# EAGLE design Omega2-IO-Power-Full (EAGLE 7.7.0)
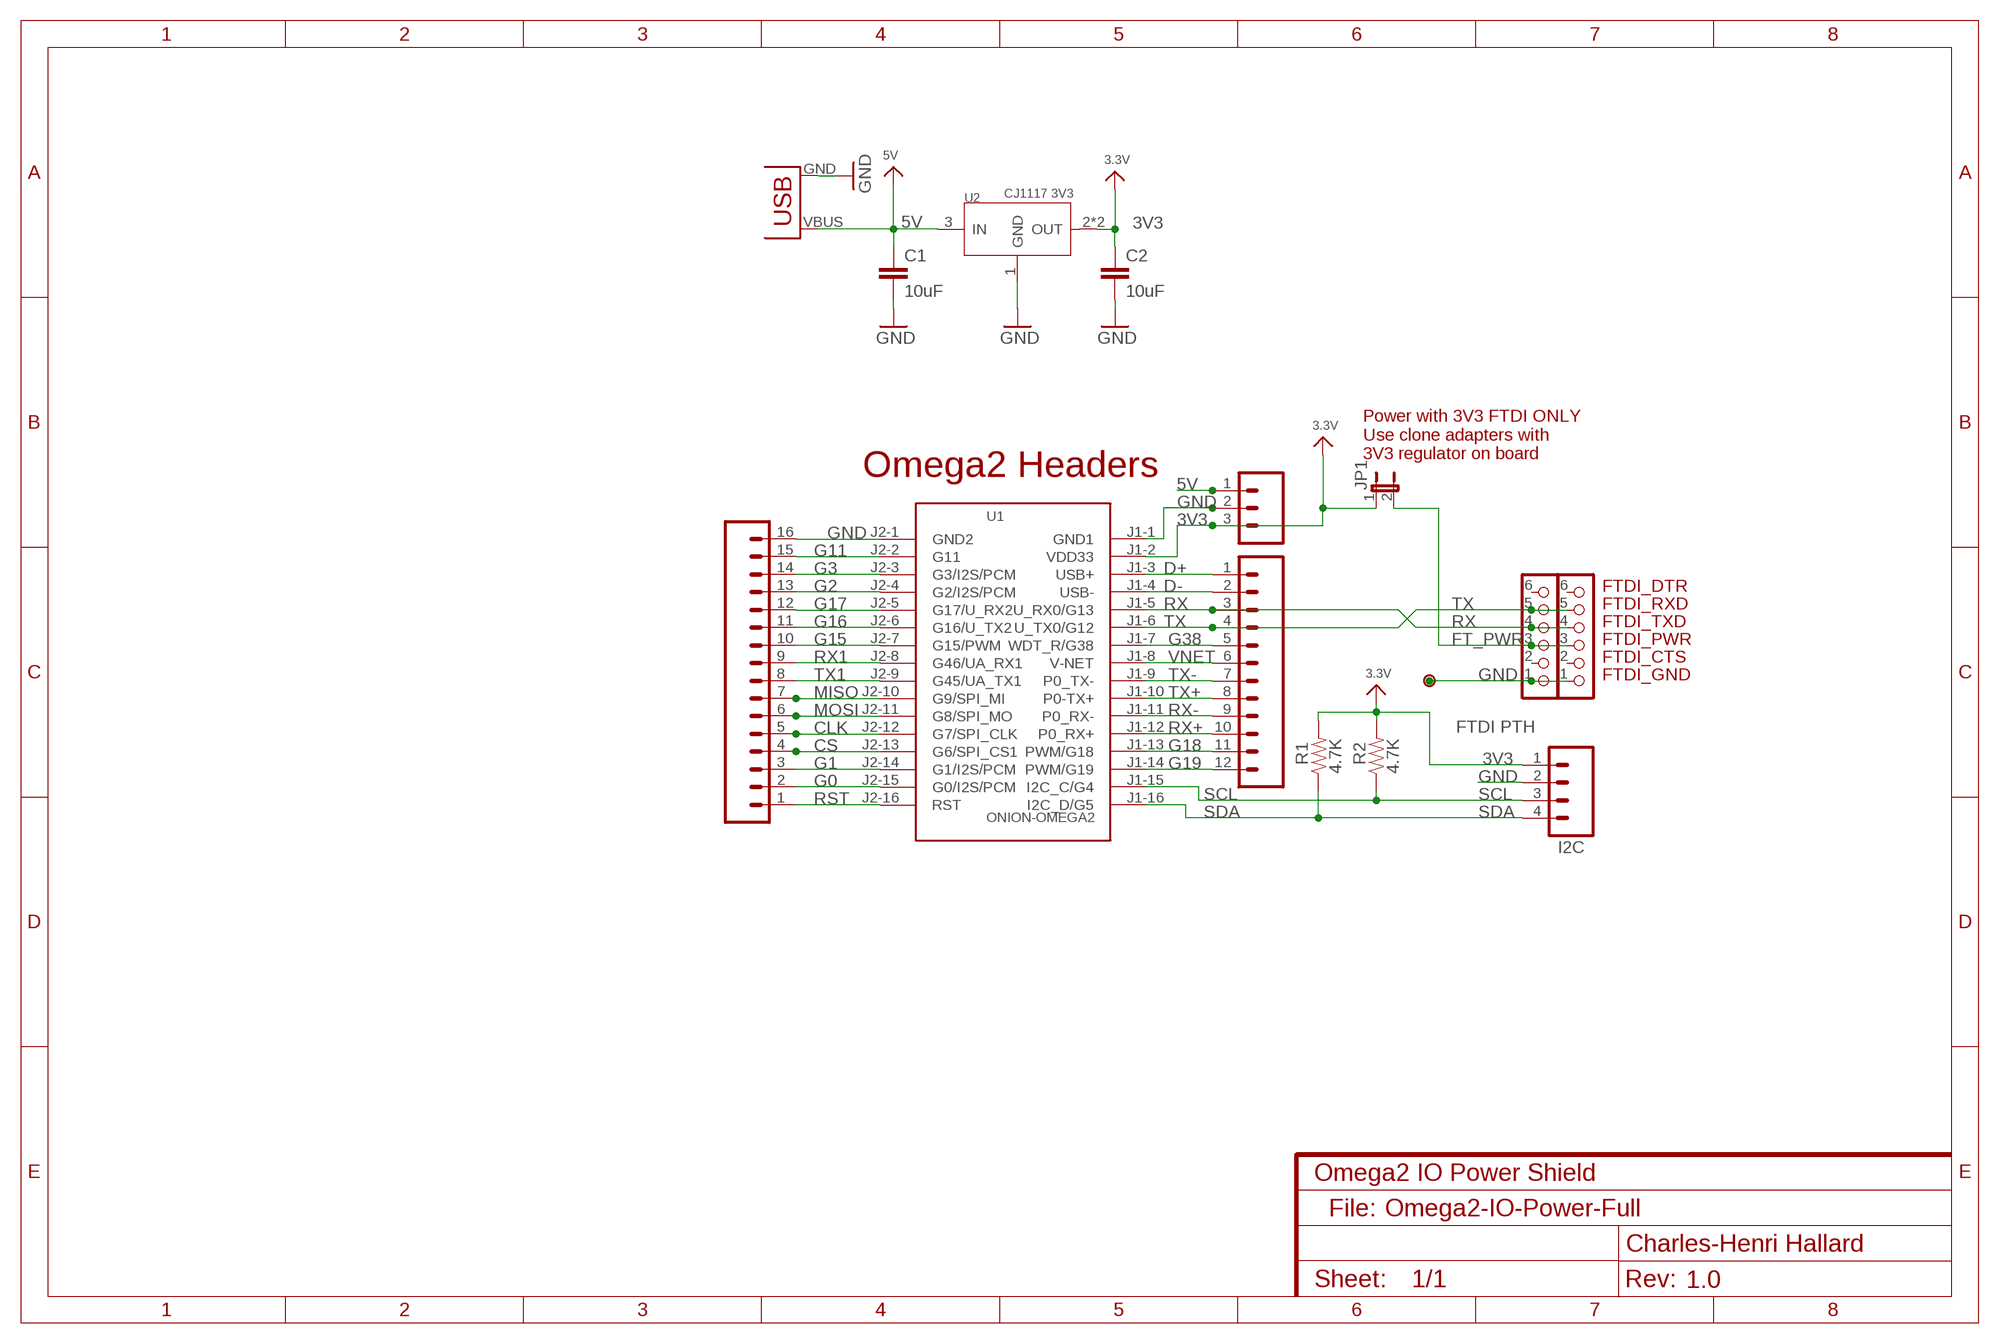
[diagram p0: schematic, sheet 1]
NAME (FRAME-A4L): CNAME: Omega2 IO Power Shield; CREVISION: 1.0; DESIGNER: Charles-Henri Hallard

## Parts
C1  10uF  CAP0805-CAP-LARGEPADS  [0805-CAP-LARGEPADS]
C2  10uF  CAP0805-CAP-LARGEPADS  [0805-CAP-LARGEPADS]
FTDI  CON_HEADER_1X06-PTH  [M1X6]
I2C  M04PTH  [1X04]
J1  M16PTH  [1X16]
J2  M12PTH  [1X12]
J7  M03PTH  [1X03]
JP1  JUMPER2  [JUMPER2]
P2  PADNORMAL  [PAD]
PTH  CON_HEADER_1X06  [M1X6_MALE_RIGHT_ANGLED_SMD_NO_HOLES]
R1  4.7K  RESISTOR0805-RES  [0805-RES]
R2  4.7K  RESISTOR0805-RES  [0805-RES]
U1  ONION-OMEGA2  [ONION-2MM-2X16]
U2  CJ1117 3V3  CJ1117-3.3-1310120P1  [SOT89]
USB  USB_POWER  [USB_MINIB_POWER]

## Nets
3V3: C2.1 I2C.1 J7.3 JP1.1 R1.2 R2.2 U1.J1-2(VDD33) U2.2(OUT) U2.4(OUT) ; supply symbol labelled 3.3V
5V: C1.1 J7.1 U2.3(IN) USB.VBUS(VCC)
CLK: J1.5 U1.J2-12(G7/SPI_CLK)
CS: J1.4 U1.J2-13(G6/SPI_CS1)
D+: J2.1 U1.J1-3(USB+)
D-: J2.2 U1.J1-4(USB-)
FT_PWR: FTDI.3 JP1.2 PTH.3
G0: J1.2 U1.J2-15(G0/I2S/PCM)
G1: J1.3 U1.J2-14(G1/I2S/PCM)
G2: J1.13 U1.J2-4(G2/I2S/PCM)
G3: J1.14 U1.J2-3(G3/I2S/PCM)
G11: J1.15 U1.J2-2(G11)
G15: J1.10 U1.J2-7(G15/PWM)
G16: J1.11 U1.J2-6(G16/U_TX2)
G17: J1.12 U1.J2-5(G17/U_RX2)
G18: J2.11 U1.J1-13(PWM/G18)
G19: J2.12 U1.J1-14(PWM/G19)
G38: J2.5 U1.J1-7(WDT_R/G38)
GND: C1.2 C2.2 FTDI.1 I2C.2 J1.16 J7.2 P2.1 PTH.1 U1.J1-1(GND1) U1.J2-1(GND2) U2.1(GND) USB.GND
MISO: J1.7 U1.J2-10(G9/SPI_MI)
MOSI: J1.6 U1.J2-11(G8/SPI_MO)
RST: J1.1 U1.J2-16(RST)
RX: FTDI.4 J2.3 PTH.4 U1.J1-5(U_RX0/G13)
RX1: J1.9 U1.J2-8(G46/UA_RX1)
RX+: J2.10 U1.J1-12(P0_RX+)
RX-: J2.9 U1.J1-11(P0_RX-)
SCL: I2C.3 R2.1 U1.J1-15(I2C_C/G4)
SDA: I2C.4 R1.1 U1.J1-16(I2C_D/G5)
TX: FTDI.5 J2.4 PTH.5 U1.J1-6(U_TX0/G12)
TX1: J1.8 U1.J2-9(G45/UA_TX1)
TX+: J2.8 U1.J1-10(P0-TX+)
TX-: J2.7 U1.J1-9(P0_TX-)
VNET: J2.6 U1.J1-8(V-NET)
Unconnected: FTDI.2 FTDI.6 PTH.2 PTH.6

## Notes on the sheet
- Power with 3V3 FTDI ONLY
  Use clone adapters with
  3V3 regulator on board
- Omega2 Headers
- FTDI_DTR
- FTDI_RXD
- FTDI_TXD
- FTDI_PWR
- FTDI_CTS
- FTDI_GND
- File:

## Library data of the parts
C1 C2 = _c2h:CAP: Capacitor Standard 0603 ceramic capacitor, and 0.1" leaded capacitor.
FTDI PTH = _c2h:CON_HEADER_1X06
I2C = SparkFun-Connectors:M04: Header 4 Standard 4-pin 0.1" header. Use with straight break away headers (SKU : PRT-00116), right angle break away headers (PRT-00553), swiss pins (PRT-00743), machine pins (PRT-00117), and female headers (PRT-00115). Molex polarized connector foot print use with SKU : PRT-08231 with associated crimp pins and housings. 1MM SMD Version SKU: PRT-10208; PROD_ID: CONN-09696
J1 = SparkFun-Connectors:M16: 1x16 .1" header
J2 = SparkFun-Connectors:M12: Header 12 Standard 12-pin 0.1" header. Use with straight break away headers (SKU : PRT-00116), right angle break away headers (PRT-00553), swiss pins (PRT-00743), machine pins (PRT-00117), and female headers (PRT-00115).
J7 = SparkFun-Connectors:M03: Header 3 Standard 3-pin 0.1" header. Use with straight break away headers (SKU : PRT-00116), right angle break away headers (PRT-00553), swiss pins (PRT-00743), machine pins (PRT-00117), and female headers (PRT-00115). Molex polarized connector foot print use with SKU : PRT-08232 with associated crimp pins and housings.
JP1 = microbuilder:JUMPER2: JUMPER - 2 Pins
P2 = _c2h:PAD
R1 R2 = _c2h:RESISTOR: Resistor Basic schematic elements and footprints for 0603, 1206, and PTH resistors.
U1 = Onion2:ONION-OMEGA2: Onion Omega
U2 = Seeed-IC:CJ1117-3.3: 1A Low Dropout Linear Regulator
USB = _c2h:USB_POWER

## Net classes
0 default: width 0.203 mm, drill 0.356 mm, clearance 0.152 mm
1 power: width 0.203 mm, clearance 0.152 mm

## Board
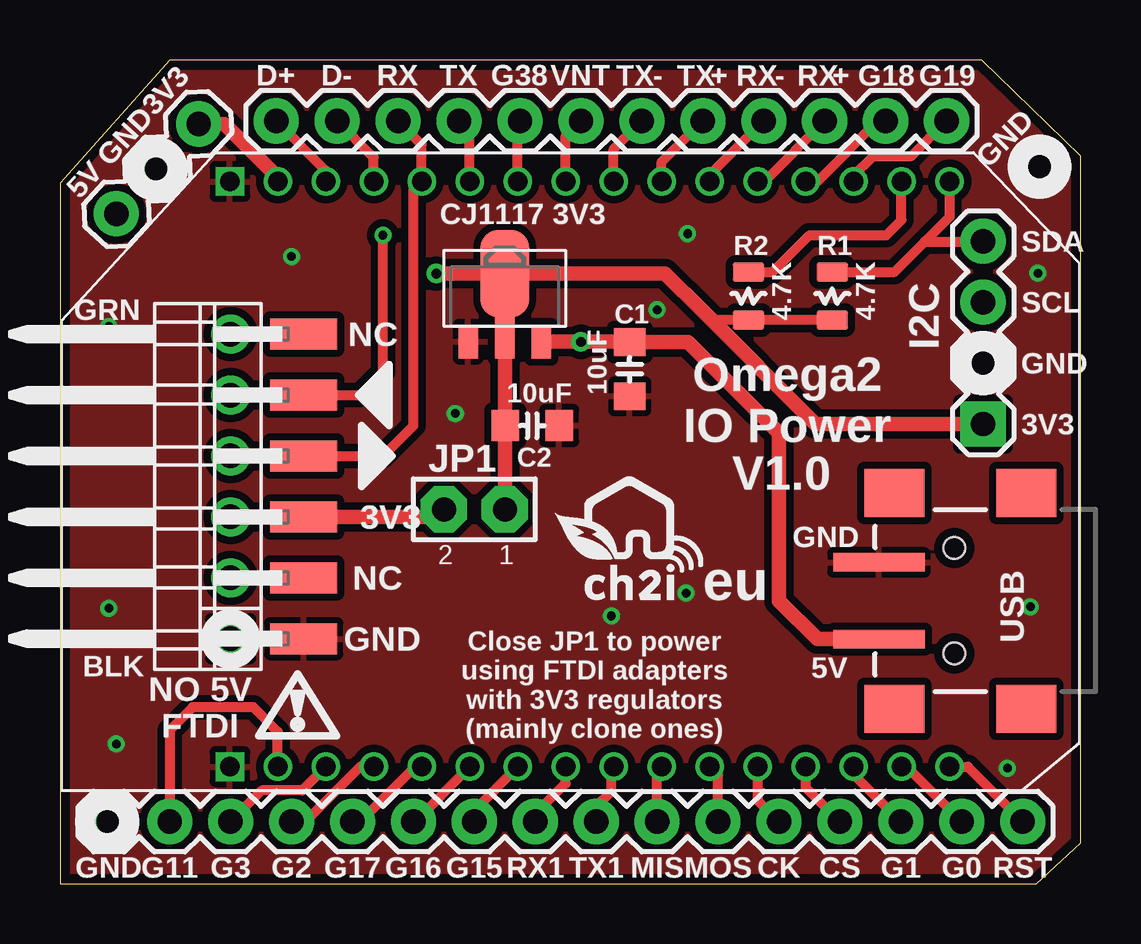
[diagram p1: board, top side]
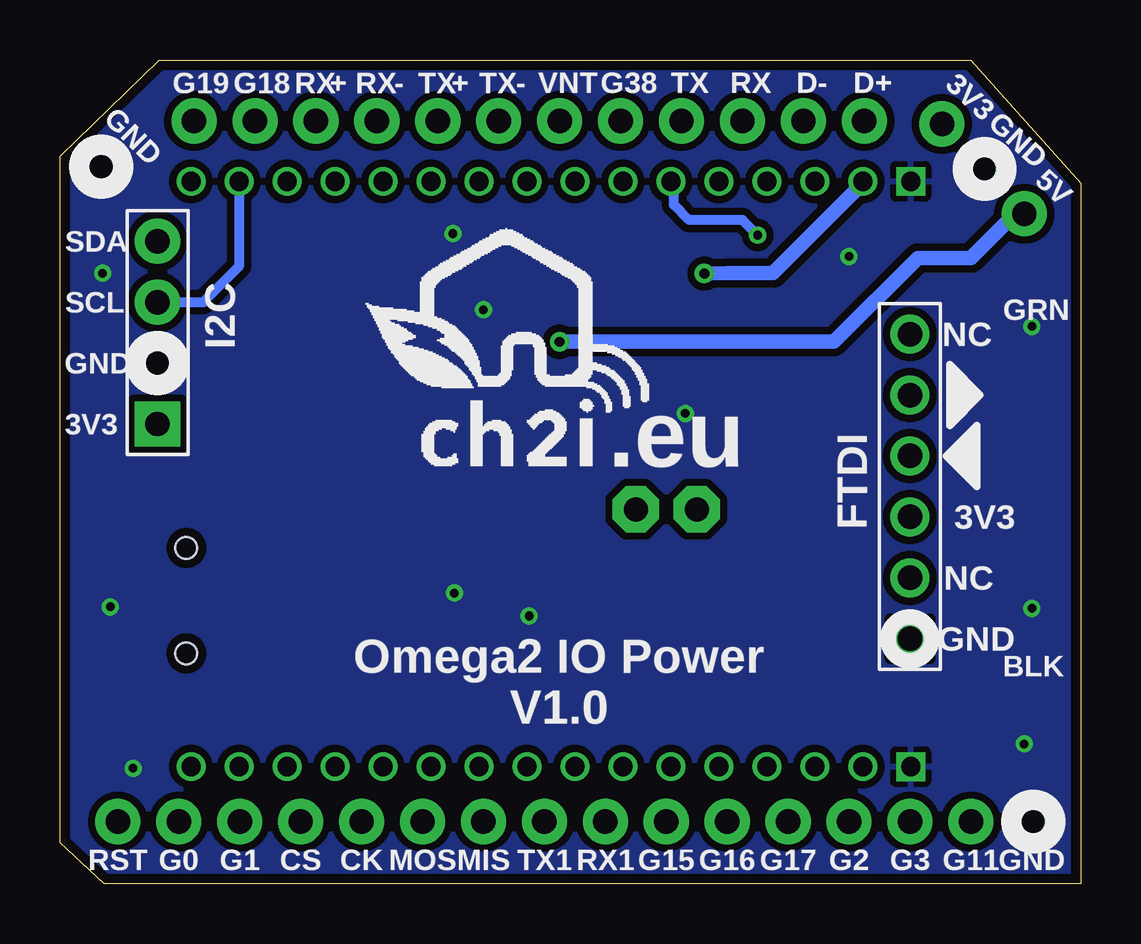
[diagram p2: board, bottom side, seen from below]

Size 42.55 x 34.35 mm. Coordinates in mm from the lower left corner, seen from the top.
Outline: 0,29.21 0,0 40.7,0 42.55,1.71 42.55,30.35 38.42,34.35 4.57,34.35 0,29.21
Copper layers (1*16): Top 0.0356mm / dielectric 1.5011mm / Bottom 0.0356mm
Design rules "PCBs_io": minimum track width 6mil, minimum drill 13mil, track to track 6mil, track to pad 6mil, pad to pad 6mil, via to via 6mil, smd to smd 6mil, copper to edge 15mil, drill to drill 6mil, minimum pad ring 7mil, minimum via ring 7mil, stop-mask expansion 3mil, vias tented up to drill 40mil, thermal gap 10mil

### Footprints (pad centres in the part's own frame; a part is rotated, then mirrored left to right if it is on the bottom)
0805-CAP-LARGEPADS = smd 1.156 x 1.3: 1 -1.127,0; 2 1.127,0
M1X6 = drill 1.02 pad 1.632 square: 1 0,0 | drill 1.02 pad 1.632: 2 2.54,0; 3 5.08,0; 4 7.62,0; 5 10.16,0; 6 12.7,0
1X04 = drill 1.016 pad 1.88 square: 1 0,0 | drill 1.016 pad 1.88: 2 2.54,0; 3 5.08,0; 4 7.62,0
1X16 = drill 1.016 pad 1.88: 1 0,0; 2 2.54,0; 3 5.08,0; 4 7.62,0; 5 10.16,0; 6 12.7,0; 7 15.24,0; 8 17.78,0; 9 20.32,0; 10 22.86,0; 11 25.4,0; 12 27.94,0; 13 30.48,0; 14 33.02,0; 15 35.56,0; 16 38.1,0
1X12 = drill 1.016 pad 1.88: 1 0,0; 2 2.54,0; 3 5.08,0; 4 7.62,0; 5 10.16,0; 6 12.7,0; 7 15.24,0; 8 17.78,0; 9 20.32,0; 10 22.86,0; 11 25.4,0; 12 27.94,0
1X03 = drill 1.016 pad 1.88: 1 0,0; 2 2.54,0; 3 5.08,0
JUMPER2 = drill 1 pad 1.93 octagon: 1 2.54,0; 2 0,0
PAD = drill 1.016 pad 1.88: 1 0,0
M1X6_MALE_RIGHT_ANGLED_SMD_NO_HOLES = smd 1.3 x 2.8: 1 -6.35,-4.951; 2 -3.81,-4.951; 3 -1.27,-4.951; 4 1.27,-4.951; 5 3.81,-4.951; 6 6.35,-4.951
0805-RES = smd 0.8 x 1.3: 1 -1,0; 2 1,0
ONION-2MM-2X16 = drill 0.8 square: J1-1 12.4,14; J2-1 -12,14 | drill 0.8: J1-2 12.4,12; J1-3 12.4,10; J1-4 12.4,8; J1-5 12.4,6; J1-6 12.4,4; J1-7 12.4,2; J1-8 12.4,0; J1-9 12.4,-2; J1-10 12.4,-4; J1-11 12.4,-6; J1-12 12.4,-8; J1-13 12.4,-10; J1-14 12.4,-12; J1-15 12.4,-14; J1-16 12.4,-16; J2-2 -12,12; J2-3 -12,10; J2-4 -12,8; J2-5 -12,6; J2-6 -12,4; J2-7 -12,2; J2-8 -12,0; J2-9 -12,-2; J2-10 -12,-4; J2-11 -12,-6; J2-12 -12,-8; J2-13 -12,-10; J2-14 -12,-12; J2-15 -12,-14; J2-16 -12,-16
SOT89 = smd 0.8 x 1.4: 1 -1.524,-1.905; 3 1.524,-1.905 | smd 0.8 x 1.9: 2 0,-1.651 | smd 2.032 x 3.65: 4 0,0.94
USB_MINIB_POWER = smd 3.81 x 0.762: GND 4.405,-1.6; VBUS 4.405,1.6 | smd 2.5 x 2: GND@1 -1.73,-4.5; GND@2 -1.73,4.5; GND@3 3.77,4.5; GND@4 3.77,-4.5 | hole 0.9: 1.27,2.2; 1.27,-2.2

### Placement (x,y rotation side)
C1  23.75,21.46 270 top
C2  19.69,19.11 0 top
FTDI  7.11,10.22 90 top
I2C  38.48,19.18 90 top
J1  40.13,2.6 180 top
J2  9.02,31.81 0 top
J7  2.35,27.94 47.5 top
JP1  16,15.62 0 top
P2  40.83,29.91 0 top
PTH  5.21,16.57 90 top
R1  32.19,24.51 270 top
R2  28.7,24.51 270 top
U1  21.08,16.89 90 top
U2  18.54,24.51 0 top
U$2  [LOGO_C2I_015]  20.64,11.81 0 top
U$3  [LOGO_CH2I_110MM]  23.3,20.38 0 bottom
USB  38.54,11.81 180 top

### Tracks (layer width: path | path; a pad name or v marks a point on that pad's centre or on a via)
3V3  (via drill 0.41 pad 0.81)
  Top 0.406: R1.2 R2.2 27.16,23.51 26.8,23.88
  Top 0.61: 19.16,25.44 U2.4 | U2.4 U2.2 18.54,19.13 C2.1 18.54,19.1 JP1.1 | I2C.1 31.5,19.18 26.8,23.88 25.22,25.45 v15.69,25.45 U2.4 | J7.3 6.86,31.69 9.08,29.46 U1.J1-2
  Bottom 0.61: U1.J1-2 9.08,29.21 12.83,25.46 14.72,25.46 v15.69,25.45
5V  (via drill 0.41 pad 0.81)
  Top 0.61: USB.VBUS 31.57,10.21 29.97,11.81 29.97,18.8 26.18,22.59 C1.1 24.37,22.61 v21.72,22.61 U2.3
  Bottom 0.61: v21.72,22.61 10.29,22.61 6.79,26.1 4.57,26.1 2.73,27.94 J7.1
CLK
  Top 0.406: U1.J2-12 29.08,3.49 J1.5
CS
  Top 0.406: U1.J2-13 31.08,4.03 J1.4
D+
  Top 0.406: U1.J1-3 11.08,29.75 J2.1
D-
  Top 0.406: U1.J1-4 13.08,30.29 J2.2
FT_PWR
  Top 0.61: FTDI.3 PTH.3 15.69,15.3 JP1.2
G0
  Top 0.406: U1.J2-15 35.3,4.89 J1.2
G1
  Top 0.406: U1.J2-14 33.08,4.57 J1.3
G2
  Top 0.406: U1.J2-4 12.51,4.89 10.22,2.6 J1.13
G3
  Top 0.406: J1.14 8.41,3.9 10.1,3.9 U1.J2-3
G11
  Top 0.406: U1.J2-2 9.08,6.35 8.06,7.37 5.52,7.37 4.57,6.41 J1.15
G15
  Top 0.406: J1.10 17.27,3.08 U1.J2-7
G16
  Top 0.406: J1.11 14.79,2.6 U1.J2-6
G17
  Top 0.406: J1.12 12.51,2.6 14.8,4.89 U1.J2-5
G18
  Top 0.406: U1.J1-13 31.58,29.29 34.1,31.81 J2.11
G19
  Top 0.406: U1.J1-14 33.08,29.53 33.91,30.35 35.5,30.35 J2.12
G38
  Top 0.406: U1.J1-7 19.08,31.72 J2.5
GND  (via drill 0.36 pad 0.71)
  other vias: 2.03,23.24 2.03,11.49 39.5,4.83 40.77,25.46 22.99,11.18 26.1,12.13 24.89,23.94 9.65,26.16 16.48,19.62 26.16,27.11 40.45,11.56 2.35,5.84
  pour Bottom (isolate 0.305): 43.62,35.31 43.62,-0.89 -1.14,-0.89 -1.14,35.31
  pour Top (isolate 0.305): -0.51,34.67 42.99,34.67 42.99,-0.25 -0.51,-0.25
MISO
  Top 0.406: J1.7 24.89,4.7 U1.J2-10
MOSI
  Top 0.406: J1.6 27.43,4.54 U1.J2-11
RST
  Top 0.406: U1.J2-16 37.84,4.89 J1.1
RX
  Top 0.406: J2.3 15.08,30.83 U1.J1-5 14.73,28.94 14.73,19.11 13.46,17.84 PTH.4
  Top 0.61: PTH.4 FTDI.4
RX1
  Top 0.406: J1.9 19.81,2.92 21.08,4.19 U1.J2-8
RX+
  Top 0.406: U1.J1-12 29.35,29.29 J2.10
RX-
  Top 0.406: U1.J1-11 27.08,29.56 J2.9
SCL
  Top 0.406: R2.1 29.7,25.51 31.24,27.05 34.45,27.05 35.08,27.69 U1.J1-15
  Bottom 0.406: U1.J1-15 35.08,25.75 36.58,24.26 I2C.3
SDA
  Top 0.406: 36.05,26.78 34.78,25.51 R1.1 | 36.05,26.78 38.46,26.78 I2C.4 | U1.J1-16 37.08,27.81 36.05,26.78
TX  (via drill 0.36 pad 0.71)
  Top 0.406: U1.J1-6 17.08,31.37 J2.4 | PTH.5 12.51,20.38 13.46,21.34 v13.46,27.05
  Top 0.61: PTH.5 FTDI.5
  Bottom 0.406: v13.46,27.05 14.1,27.69 16.32,27.69 16.95,28.32 16.95,29.16 U1.J1-6
TX1
  Top 0.406: J1.8 22.35,3.24 22.99,3.87 22.99,4.8 U1.J2-9
TX+
  Top 0.406: U1.J1-10 25.08,30.1 J2.8
TX-
  Top 0.406: U1.J1-9 23.08,30.64 J2.7
VNET
  Top 0.406: U1.J1-8 21.08,31.18 J2.6

### Text on the board
tNames: D+ | D- | RX | TX | G38 | VNT | TX | - | TX | + | RX | - | RX | + | G18 | G19 | 3V3 | GND | GND | 5V | SDA | GRN | SCL | NC | GND | Omega2 / IO Power | 3V3 | JP1 | V1.0 | 3V3 | GND | NC | eu | GND | BLK | 5V | Close JP1 to power / using FTDI adapters / with 3V3 regulators / (mainly clone ones) | NO 5V / FTDI | GND | G11 | G3 | G2 | G17 | G16 | G15 | RX1 | TX1 | MIS | MOS | CK | CS | G1 | G0 | RST
bNames: 3V3 | D+ | D- | RX | TX | G38 | VNT | - | TX | + | TX | - | RX | + | RX | G18 | G19 | GND | GND | 5V | SDA | I2C | GRN | SCL | NC | GND | FTDI | .eu | 3V3 | 3V3 | NC | GND | BLK | Omega2 IO Power / V1.0 | GND | G11 | G3 | G2 | G17 | G16 | G15 | RX1 | TX1 | MIS | MOS | CK | CS | G1 | G0 | RST